# EAGLE schematic PowerSupply (EAGLE 7.1.0)
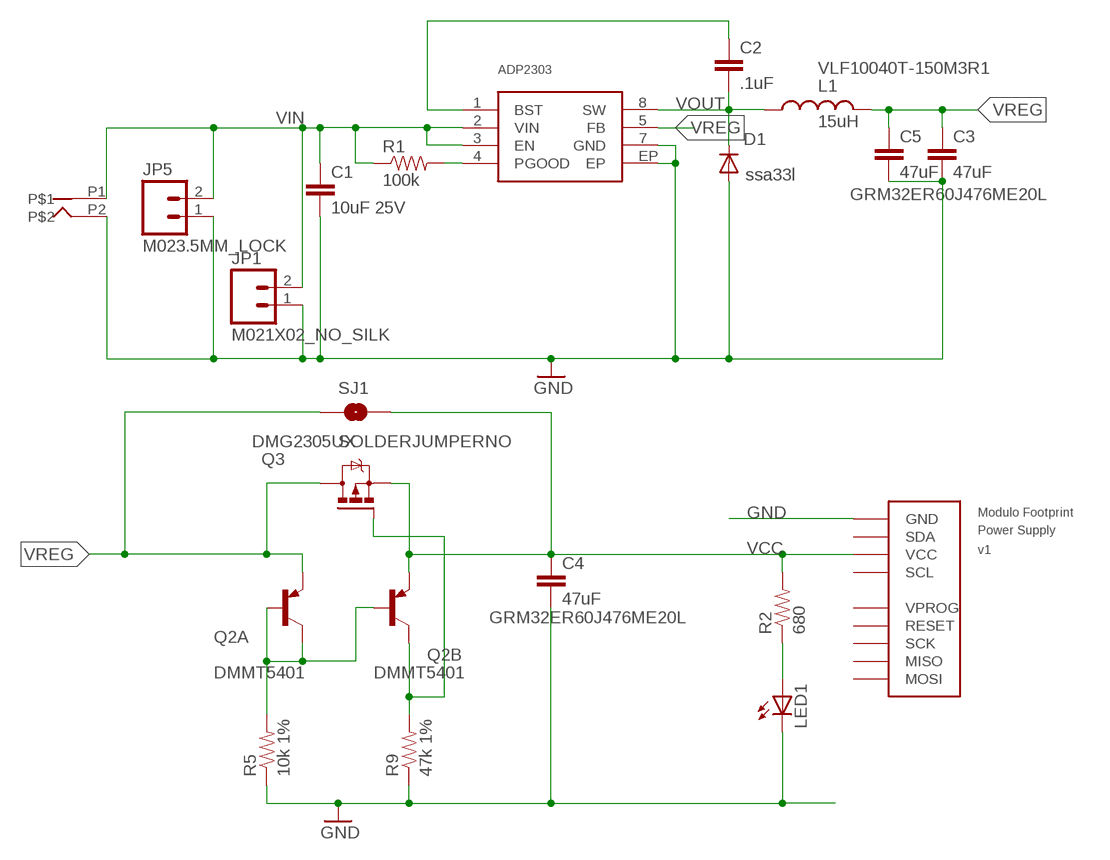
[diagram p0: schematic, sheet 1]

## Parts
C1  10uF 25V  CAP0805  [0805]
C2  .1uF  CAP0805  [0805]
C3  47uF  CAP1210  [1210]
C4  47uF  CAP1210  [1210]
C5  47uF  CAP1210  [1210]
D1  ssa33l  DIODESMA  [SMA-DIODE]
JP1  M021X02_NO_SILK  [1X02_NO_SILK]
JP5  M023.5MM_LOCK  [SCREWTERMINAL-3.5MM-2_LOCK]
L1  15uH  INDUCTORVLF10040  [INDUCTOR-VLF10040]
LED1  LEDCHIPLED_0805  [CHIPLED_0805]
Q2  DMMT5401  TRANSISTOR-DUAL-PNP  [SOT-26]
Q3  DMG2305UX  IRLML5203  [MICRO3]
R1  100k  RESISTOR0805-RES  [0805]
R2  680  RESISTOR0805-RES  [0805]
R5  10k 1%  RESISTOR0805-RES  [0805]
R9  47k 1%  RESISTOR0805-RES  [0805]
SJ1  SOLDERJUMPERNO  [SJ_2S-NO]
U$3  ADP2303  [SOIC8-EP]
U$4  FOOTPRINTFOOTPRINT-2  [FOOTPRINT2]
U$21  DC-JACK  [DC-POWER-JACK]

## Nets
GND: C1.2 C3.2 C4.2 C5.2 D1.A JP1.1 JP5.1 LED1.C R5.1 R9.1 U$3.7(GND) U$3.EP U$4.BUS0(GND) U$21.P2
N$6: R1.2 U$3.4(PGOOD)
N$8: LED1.A R2.1
N$11: C2.1 U$3.1(BST)
N$14: Q2.1(A:C) Q2.2(A:B) Q2.3(B:B) R5.2
N$16: Q2.4(B:C) Q3.1(G) R9.2
VCC: C4.1 Q2.5(B:E) Q3.2(S) R2.2 SJ1.2 U$4.BUS2(VCC)
VIN: C1.1 JP1.2 JP5.2 R1.1 U$3.2(VIN) U$3.3(EN) U$21.P1
VOUT: C2.2 D1.C L1.P$1 U$3.8(SW)
VREG: C3.1 C5.1 L1.P$2 Q2.6(A:E) Q3.3(D) SJ1.1 U$3.5(FB)
Unconnected: U$4.BUS1(SDA) U$4.BUS3(SCL) U$4.PROG0(VPROG) U$4.PROG1(RESET) U$4.PROG2(SCK) U$4.PROG3(MISO) U$4.PROG4(MOSI)

## Notes on the sheet
- VLF10040T-150M3R1
- GRM32ER60J476ME20L
- GRM32ER60J476ME20L

## Library data of the parts
C1-C5 = SparkFun-Capacitors:CAP: Capacitor Standard 0603 ceramic capacitor, and 0.1" leaded capacitor.
D1 = SparkFun-DiscreteSemi:DIODE: Diode These are standard reverse protection diodes and small signal diodes. SMA package can handle up to about 1A. SOD-323 can handle about 200mA. What the SOD-323 package when ordering, there are some mfgs out there that are 5-pin packages.
JP1 JP5 = SparkFun-Connectors:M02: Standard 2-pin 0.1" header. Use with - straight break away headers ( PRT-00116) - right angle break away headers (PRT-00553) - swiss pins (PRT-00743) - machine pins (PRT-00117) - female headers (PRT-00115) Molex polarized connector foot print use with: PRT-08233 with associated crimp pins and housings. 2.54_SCREWTERM for use with PRT-10571. 3.5mm Screw Terminal footprints for PRT-08084 5mm Screw Terminal footprints for use with PRT-08433
L1 = IntegerLabs:INDUCTOR: Inductors Basic Inductor/Choke - 0603 and 1206. Footprints are not proven and vary greatly between part numbers. SRN6045- 33uH, 20% 1.4A SDR0403-560KL - 56uH, 10%, 500mA RMS/740mA peak
LED1 = led:LED: LED OSRAM: - CHIPLED LG R971, LG N971, LY N971, LG Q971, LY Q971, LO R971, LY R971 LH N974, LH R974 LS Q976, LO Q976, LY Q976 LO Q996 - Hyper CHIPLED LW Q18S LB Q993, LB Q99A, LB R99A - SideLED LS A670, LO A670, LY A670, LG A670, LP A670 LB A673, LV A673, LT A673, LW A673 LH A674 LY A675 LS A676, LA A676, LO A676, LY A676, LW A676 LS A679, LY A679, LG A679 - Hyper Micro SIDELED® LS Y876, LA Y876, LO Y876, LY Y876 LT Y87S - SmartLED LW L88C, LW L88S LB L89C, LB L89S, LG L890 LS L89K, LO L89K, LY L89K LS L896, LA L896, LO L896, LY L896 - TOPLED LS T670, LO T670, LY T670, LG T670, LP T670 LSG T670, LSP T670, LSY T670, LOP T670, LYG T670 LG T671, LOG T671, LSG T671 LB T673, LV T673, LT T673, LW T673 LH T674 LS T676, LA T676, LO T676, LY T676, LB T676, LH T676, LSB T676, LW T676 LB T67C, LV T67C, LT T67C, LS T67K, LO T67K, LY T67K, LW E67C LS E67B, LA E67B, LO E67B, LY E67B, LB E67C, LV E67C, LT E67C LW T67C LS T679, LY T679, LG T679 LS T770, LO T770, LY T770, LG T770, LP T770 LB T773, LV T773, LT T773, LW T773 LH T774 LS E675, LA E675, LY E675, LS T675 LS T776, LA T776, LO T776, LY T776, LB T776 LHGB T686 LT T68C, LB T68C - Hyper Mini TOPLED® LB M676 - Mini TOPLED Santana® LG M470 LS M47K, LO M47K, LY M47K Source: http://www.osram.convergy.de LUXEON: - LUMILED® LXK2-PW12-R00, LXK2-PW12-S00, LXK2-PW14-U00, LXK2-PW14-V00 LXK2-PM12-R00, LXK2-PM12-S00, LXK2-PM14-U00 LXK2-PE12-Q00, LXK2-PE12-R00, LXK2-PE12-S00, LXK2-PE14-T00, LXK2-PE14-U00 LXK2-PB12-K00, LXK2-PB12-L00, LXK2-PB12-M00, LXK2-PB14-N00, LXK2-PB14-P00, LXK2-PB14-Q00 LXK2-PR12-L00, LXK2-PR12-M00, LXK2-PR14-Q00, LXK2-PR14-R00 LXK2-PD12-Q00, LXK2-PD12-R00, LXK2-PD12-S00 LXK2-PH12-R00, LXK2-PH12-S00 LXK2-PL12-P00, LXK2-PL12-Q00, LXK2-PL12-R00 Source: www.luxeon.com KINGBRIGHT: KA-3528ASYC Source: www.kingbright.com
Q2 = IntegerLabs:TRANSISTOR-DUAL-PNP: PNP Transistor
Q3 = transistor-power:IRLML5203: HEXFET P-Channel Power MOSFET
R1 = SparkFun-Resistors:RESISTOR: Resistor Basic schematic elements and footprints for 0603, 1206, and PTH resistors.
R2 R5 R9 = SparkFun-Passives:RESISTOR: Resistor Basic schematic elements and footprints for 0603, 1206, and PTH resistors.
SJ1 = SparkFun-Passives:SOLDERJUMPER: Solder Jumper Standard SMD solder jumper. Used to automate production. Two varients : Normally Open and Normally Closed are the same, but have different paste layers. NC will have a large amount of paste and should jumper during reflow.
U$3 = IntegerLabs:ADP2303
U$4 = IntegerLabs:FOOTPRINT: Modulo Footprint; BOARD: Power Supply; VERSION: v1
U$21 = IntegerLabs:DC-JACK